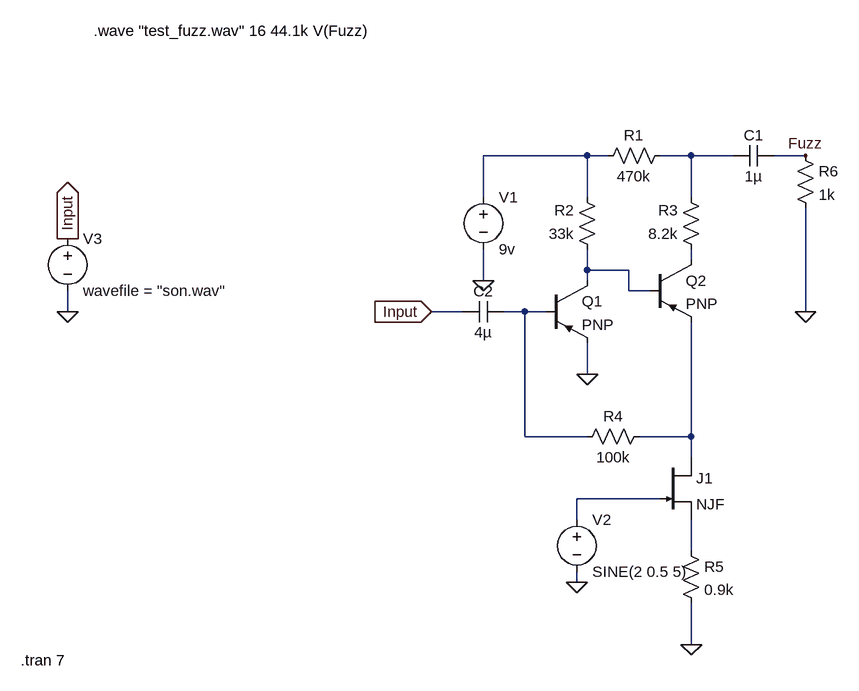
[diagram p0: schematic fuzz.asc]
fuzz.asc, the LTspice schematic file:
Version 4
SHEET 1 880 680
WIRE 144 -128 -16 -128
WIRE 176 -128 144 -128
WIRE 304 -128 256 -128
WIRE 368 -128 304 -128
WIRE 480 -128 432 -128
WIRE -16 -64 -16 -128
WIRE 144 -64 144 -128
WIRE 304 -64 304 -128
WIRE 304 32 304 16
WIRE 144 48 144 16
WIRE 208 48 144 48
WIRE -16 64 -16 16
WIRE 144 64 144 48
WIRE 208 80 208 48
WIRE 240 80 208 80
WIRE -656 112 -656 80
WIRE -48 112 -96 112
WIRE 48 112 16 112
WIRE 80 112 48 112
WIRE 480 112 480 -48
WIRE 144 208 144 160
WIRE 48 304 48 112
WIRE 144 304 48 304
WIRE 304 304 304 128
WIRE 304 304 224 304
WIRE 304 336 304 304
WIRE 256 400 128 400
WIRE 128 432 128 400
WIRE 304 480 304 432
WIRE 128 528 128 512
WIRE 304 624 304 560
FLAG 144 208 0
FLAG -16 64 0
FLAG 304 624 0
FLAG 480 112 0
FLAG 128 528 0
FLAG 480 -128 Fuzz
FLAG -656 112 0
FLAG -656 0 Input
IOPIN -656 0 Out
FLAG -96 112 Input
IOPIN -96 112 In
SYMBOL voltage -16 -80 R0
WINDOW 123 0 0 Left 0
WINDOW 39 0 0 Left 0
SYMATTR InstName V1
SYMATTR Value 9v
SYMBOL res 272 -144 R90
WINDOW 0 0 56 VBottom 2
WINDOW 3 32 56 VTop 2
SYMATTR InstName R1
SYMATTR Value 470k
SYMBOL res 160 32 R180
WINDOW 0 36 76 Left 2
WINDOW 3 36 40 Left 2
SYMATTR InstName R2
SYMATTR Value 33k
SYMBOL res 320 32 R180
WINDOW 0 36 76 Left 2
WINDOW 3 36 40 Left 2
SYMATTR InstName R3
SYMATTR Value 8.2k
SYMBOL cap 432 -144 R90
WINDOW 0 0 32 VBottom 2
WINDOW 3 32 32 VTop 2
SYMATTR InstName C1
SYMATTR Value 1µ
SYMBOL pnp 80 64 R0
SYMATTR InstName Q1
SYMBOL pnp 240 32 R0
SYMATTR InstName Q2
SYMBOL res 240 288 R90
WINDOW 0 0 56 VBottom 2
WINDOW 3 32 56 VTop 2
SYMATTR InstName R4
SYMATTR Value 100k
SYMBOL njf 256 336 R0
SYMATTR InstName J1
SYMBOL voltage 128 416 R0
WINDOW 123 0 0 Left 0
WINDOW 39 0 0 Left 0
SYMATTR InstName V2
SYMATTR Value SINE(2 0.5 5)
SYMBOL res 288 464 R0
SYMATTR InstName R5
SYMATTR Value 0.9k
SYMBOL cap 16 96 R90
WINDOW 0 0 32 VBottom 2
WINDOW 3 32 32 VTop 2
SYMATTR InstName C2
SYMATTR Value 4µ
SYMBOL res 464 -144 R0
SYMATTR InstName R6
SYMATTR Value 1k
SYMBOL voltage -656 -16 R0
WINDOW 123 0 0 Left 0
WINDOW 39 0 0 Left 0
SYMATTR InstName V3
SYMATTR Value wavefile = "son.wav"
TEXT -616 -320 Left 2 !.wave "test_fuzz.wav" 16 44.1k V(Fuzz)
TEXT -728 648 Left 2 !.tran 7

The netlist it stands for:
* fuzz.asc
V1 N001 0 9v
R1 N002 N001 470k
R2 N004 N001 33k
R3 N003 N002 8.2k
C1 Fuzz N002 1µ
Q1 N004 N005 0 0 PNP
Q2 N003 N004 N006 0 PNP
R4 N006 N005 100k
J1 N006 N007 N008 NJF
V2 N007 0 SINE(2 0.5 5)
R5 N008 0 0.9k
C2 N005 Input 4µ
R6 Fuzz 0 1k
V3 Input 0 wavefile = "son.wav"
.model NPN NPN
.model PNP PNP
.lib standard.bjt
.model NJF NJF
.model PJF PJF
.lib standard.jft
.wave "test_fuzz.wav" 16 44.1k V(Fuzz)
.tran 7
.backanno
.end